# EAGLE design 180 schematic 3 layer (EAGLE 9.6.2)
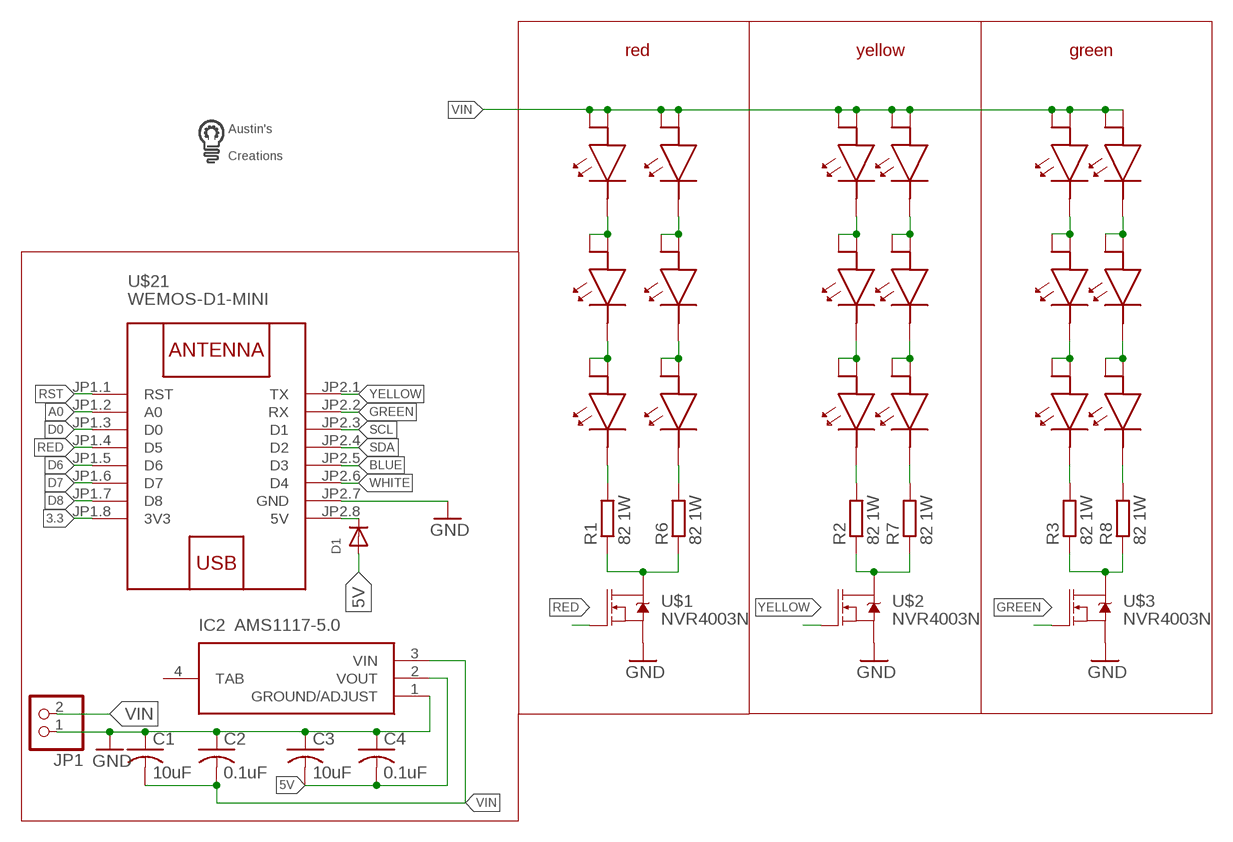
[diagram p0: schematic, sheet 1]

## Parts
C1  10uF  C-USC0603  [C0603]
C2  0.1uF  C-USC0603  [C0603]
C3  10uF  C-USC0603  [C0603]
C4  0.1uF  C-USC0603  [C0603]
D1  DIODESOD-123  [SOD-123]
IC2  AMS1117-5.0  [SOT229P700X180-4N]
JP1  PINHD-1X2  [1X02]
R1  82 1W  R-EU_R2010  [R2010]
R2  82 1W  R-EU_R2010  [R2010]
R3  82 1W  R-EU_R2010  [R2010]
R6  82 1W  R-EU_R2010  [R2010]
R7  82 1W  R-EU_R2010  [R2010]
R8  82 1W  R-EU_R2010  [R2010]
U$1  NVR4003N  [SOT23]
U$2  NVR4003N  [SOT23]
U$3  NVR4003N  [SOT23]
U$6  5730LED  [5730LED]
U$7  5730LED  [5730LED]
U$8  5730LED  [5730LED]
U$9  5730LED  [5730LED]
U$10  5730LED  [5730LED]
U$11  5730LED  [5730LED]
U$12  5730LED  [5730LED]
U$13  5730LED  [5730LED]
U$14  5730LED  [5730LED]
U$21  WEMOS-D1-MINI  [WEMOS-D1-MINI]
U$22  LOGO  [LOGO]
U$23  5730LED  [5730LED]
U$24  5730LED  [5730LED]
U$25  5730LED  [5730LED]
U$26  5730LED  [5730LED]
U$27  5730LED  [5730LED]
U$28  5730LED  [5730LED]
U$29  5730LED  [5730LED]
U$30  5730LED  [5730LED]
U$31  5730LED  [5730LED]

## Nets
3.3: U$21.JP1.8(3V3)
5V: C3.2 C4.2 D1.A IC2.2(VOUT)
A0: U$21.JP1.2(A0)
BLUE: U$21.JP2.5(D3)
D0: U$21.JP1.3(D0)
D6: U$21.JP1.5(D6)
D7: U$21.JP1.6(D7)
D8: U$21.JP1.7(D8)
GND: C1.1 C2.1 C3.1 C4.1 IC2.1(GROUND/ADJUST) JP1.1 U$1.3(S) U$2.3(S) U$3.3(S) U$21.JP2.7(GND)
GREEN: U$3.2(G) U$21.JP2.2(RX)
N$1: D1.C U$21.JP2.8(5V)
N$2: U$6.P$2 U$7.P$1 U$7.P$3
N$3: U$9.P$2 U$10.P$1 U$10.P$3
N$4: R1.1 R6.1 U$1.1(D)
N$5: R2.1 R7.1 U$2.1(D)
N$6: U$12.P$2 U$13.P$1 U$13.P$3
N$9: U$7.P$2 U$8.P$1 U$8.P$3
N$10: R1.2 U$8.P$2
N$11: R2.2 U$11.P$2
N$12: R3.2 U$14.P$2
N$17: U$13.P$2 U$14.P$1 U$14.P$3
N$18: U$10.P$2 U$11.P$1 U$11.P$3
N$19: U$23.P$2 U$24.P$1 U$24.P$3
N$20: U$24.P$2 U$25.P$1 U$25.P$3
N$21: R3.1 R8.1 U$3.1(D)
N$24: R6.2 U$25.P$2
N$25: U$29.P$2 U$30.P$1 U$30.P$3
N$26: U$26.P$2 U$27.P$1 U$27.P$3
N$27: R7.2 U$28.P$2
N$28: U$27.P$2 U$28.P$1 U$28.P$3
N$29: R8.2 U$31.P$2
N$30: U$30.P$2 U$31.P$1 U$31.P$3
RED: U$1.2(G) U$21.JP1.4(D5)
RST: U$21.JP1.1(RST)
SCL: U$21.JP2.3(D1)
SDA: U$21.JP2.4(D2)
VIN: C1.2 C2.2 IC2.3(VIN) JP1.2 U$6.P$1 U$6.P$3 U$9.P$1 U$9.P$3 U$12.P$1 U$12.P$3 U$23.P$1 U$23.P$3 U$26.P$1 U$26.P$3 U$29.P$1 U$29.P$3
WHITE: U$21.JP2.6(D4)
YELLOW: U$2.2(G) U$21.JP2.1(TX)
Unconnected: IC2.4(TAB)

## Notes on the sheet
- red | yellow | green

## Library data of the parts
C1-C4 = adafruit:C-US: CAPACITOR, American symbol
D1 = adafruit:DIODE: Diode SMADIODE - SMA Surface Mount Package 20V 1A Schottky Diode Digikey: 641-1014-6-ND DO-1N4148 - Through Hole Small Current Diode SOD-123 20V 1 A (.5mV Vf) Schottky Diode - Digikey: MBRX120TPMSCT-ND SOD-323 10V 570mA (.38mV Vf, 3ns) Schottky Diode - Digikey: ZLLS410CT-ND SOD-523 30V 30mA Schottky Diode (RB751S-40TE61) - Digikey: RB751S-40TE61CT-ND SOT23-R/W - SOT23 Package (R = Solder Paste/Reflow Ovens, W = Hand-Soldering) BAT54Film 40V 300mA - Digikey: 497-7162-1-ND
IC2 = SamacSys_Parts:AMS1117-5.0: 1A LOW DROPOUT VOLTAGE REGULATOR Source: Datasheet <http://www.advanced-monolithic.com/pdf/ds1117.pdf>; DESCRIPTION: 1A LOW DROPOUT VOLTAGE REGULATOR; HEIGHT: 1.8mm; MANUFACTURER_NAME: Advanced Monolithic Systems; MANUFACTURER_PART_NUMBER: AMS1117-5.0
JP1 = pinhead:PINHD-1X2: PIN HEADER
R1-R3 R6-R8 = rcl:R-EU_: RESISTOR, European symbol; SPICEPREFIX: R
U$1-U$3 = custom parts:NVR4003N
U$6-U$14 U$23-U$31 = custom parts:5730LED
U$21 = diy-modules:WEMOS-D1-MINI: WEMOS D1 mini: Mini Wi-Fi Board based on ESP-8266 device More details can be found here: https://www.wemos.cc/product/d1-mini.html Click here to find device on ebay.com <http://www.ebay.com/sch/wemos+d1+mini+nodemcu>
U$22 = custom parts:LOGO

## Board
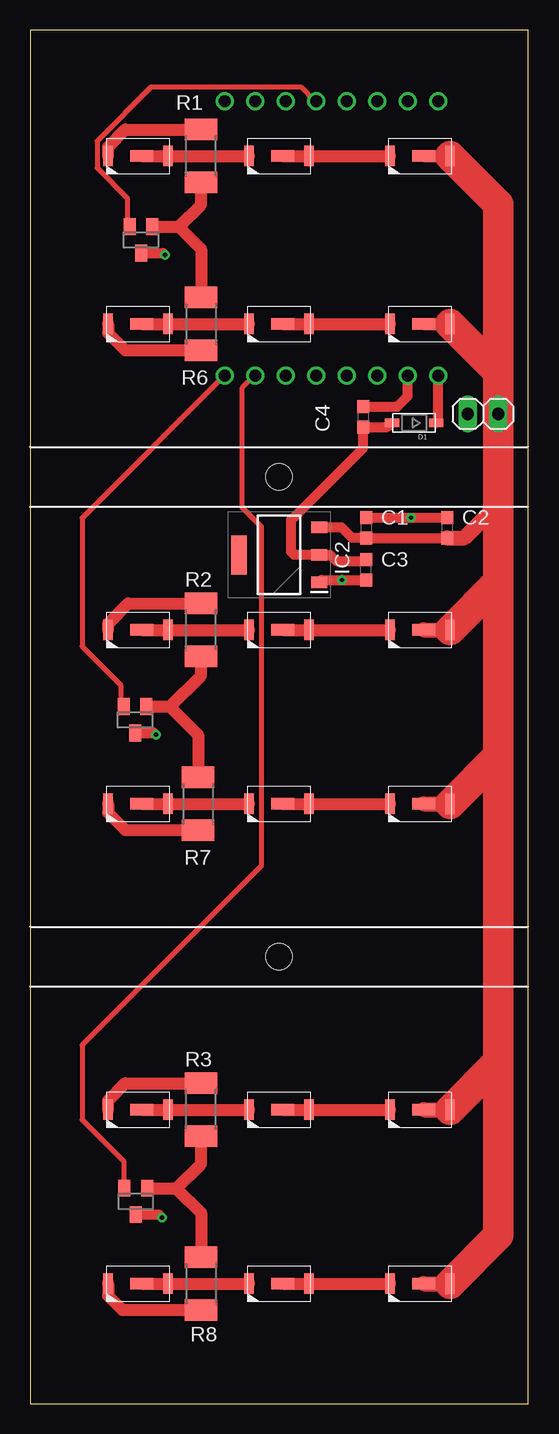
[diagram p1: board, top side]
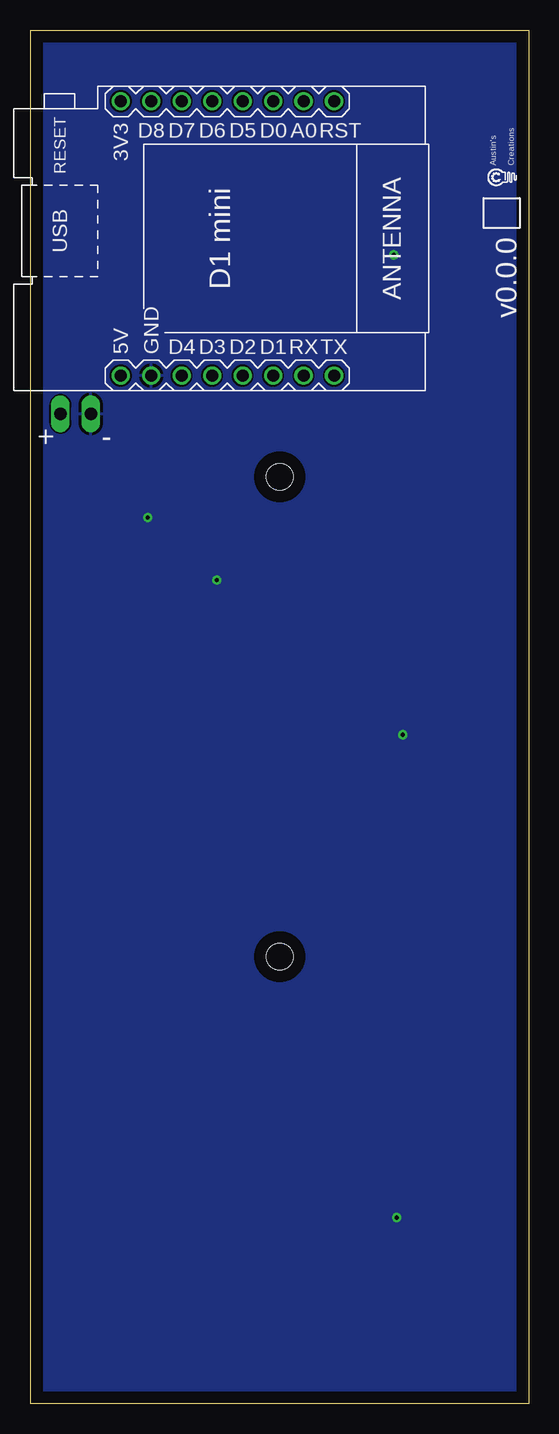
[diagram p2: board, bottom side, seen from below]

Size 41.5 x 114.5 mm. Coordinates in mm from the lower left corner, seen from the top.
Outline: 0,0 41.5,0 41.5,114.5 0,114.5 0,0
Copper layers (1*16): Top 0.035mm / dielectric 1.5mm / Bottom 0.035mm
Design rules "default *": minimum track width 16mil, minimum drill 0.35mm, track to track 6mil, track to pad 6mil, pad to pad 6mil, via to via 6mil, smd to smd 6mil, copper to edge 40mil, drill to drill 6mil, minimum pad ring 10mil, minimum via ring 8mil, stop-mask expansion 4mil, vias tented up to drill 0mil, thermal gap 10mil
Holes 2.2 mm at 20.75,77.25 20.75,37.25

### Footprints (pad centres in the part's own frame; a part is rotated, then mirrored left to right if it is on the bottom)
C0603 = smd 1.1 x 1: 1 -0.85,0; 2 0.85,0
SOD-123 = smd 1.2 x 0.7: A 1.85,0; C -1.85,0
SOT229P700X180-4N = smd 1.3 x 0.95: 1 -3.35,2.29; 2 -3.35,0; 3 -3.35,-2.29 | smd 1.3 x 3.25: 4 3.35,0
1X02 = drill 1.016 long: 1 -1.27,0; 2 1.27,0
R2010 = smd 1.8 x 2.7: 1 -2.2,0; 2 2.2,0
SOT23 = smd 1 x 1.4: 1 -0.95,-1.1; 2 0.95,-1.1; 3 0,1.1
5730LED = smd 0.813 x 1.676: P$1 -2.5,0; P$2 2.5,0 | smd 1.93 x 0.965: P$3 -0.3,0
WEMOS-D1-MINI = drill 1: JP1.1 -11.43,9.525; JP1.2 -11.43,6.985; JP1.3 -11.43,4.445; JP1.4 -11.43,1.905; JP1.5 -11.43,-0.635; JP1.6 -11.43,-3.175; JP1.7 -11.43,-5.715; JP1.8 -11.43,-8.255; JP2.1 11.43,9.525; JP2.2 11.43,6.985; JP2.3 11.43,4.445; JP2.4 11.43,1.905; JP2.5 11.43,-0.635; JP2.6 11.43,-3.175; JP2.7 11.43,-5.715; JP2.8 11.43,-8.255

### Placement (x,y rotation side)
C1  28,73 270 top
C2  34.75,73 270 top
C3  28,69.5 90 top
C4  27.75,82.25 270 top
D1  32,81.75 180 top
IC2  20.75,70.75 180 top
JP1  37.75,82.5 0 top
R1  14.25,104 90 top
R2  14.25,64.5 90 top
R3  14.25,24.5 90 top
R6  14.25,90 270 top
R7  14,50 270 top
R8  14.25,10 270 top
U$1  9.25,97 180 top
U$2  8.75,57 180 top
U$3  8.82,16.86 180 top
U$6  32.5,104 180 top
U$7  20.75,104 180 top
U$8  9,104 180 top
U$9  32.5,64.5 180 top
U$10  20.75,64.5 180 top
U$11  9,64.5 180 top
U$12  32.5,24.5 180 top
U$13  20.75,24.5 180 top
U$14  9,24.5 180 top
U$21  25.75,97.12 270 bottom
U$22  1,101.5 90 bottom
U$23  32.5,90 180 top
U$24  20.75,90 180 top
U$25  9,90 180 top
U$26  32.5,50 180 top
U$27  20.75,50 180 top
U$28  9,50 180 top
U$29  32.5,10 180 top
U$30  20.75,10 180 top
U$31  9,10 180 top

### Tracks (layer width: path | path; a pad name or v marks a point on that pad's centre or on a via)
5V
  Top 0.813: C3.2 27.9,70.25 25.5,70.25 25,70.75 IC2.2 22,70.75 21.75,71 21.75,73.65 27.75,79.65 C4.2 29.8,81.4 D1.A
GND  (via drill 0.35)
  Top 0.813: C1.1 v31.75,73.85 C2.1 | IC2.1 24.29,68.65 v26,68.65 C3.1 | U$2.3 10.35,55.9 v10.5,55.75 | U$1.3 11.1,95.9 v11.25,95.75 | U$3.3 10.74,15.76 v11,15.5 | C4.1 30.6,83.1 31.46,83.97 U$21.JP2.7
  pour Bottom: 0,114.5 0,0 41.5,0 41.5,114.5
GREEN
  Top 0.406: U$3.2 7.82,18.07 7.82,20.17 4.34,23.66 4.34,29.89 19.28,44.83 19.28,73.1 17.66,74.71 17.66,84.62 18.72,85.68 U$21.JP2.2
N$1
  Top 0.813: D1.C 34.01,81.91 U$21.JP2.8
N$2
  Top 1.016: U$7.P$3 U$7.P$1 U$6.P$2
N$3
  Top 1.016: U$10.P$3 U$10.P$1 U$9.P$2
N$4
  Top 1.016: R6.1 14.25,96.25 12.4,98.1 | 12.4,98.1 14.25,99.95 R1.1 | U$1.1 12.4,98.1
N$5
  Top 1.016: R7.1 14,55.75 11.65,58.1 | 11.65,58.1 14.25,60.7 R2.1 | U$2.1 11.65,58.1
N$6
  Top 1.016: U$13.P$3 U$13.P$1 U$12.P$2
N$9
  Top 1.016: U$8.P$3 U$8.P$1 U$7.P$2
N$10
  Top 1.016: U$8.P$2 6.5,104.75 7.95,106.2 R1.2
N$11
  Top 1.016: U$11.P$2 6.5,65 8.2,66.7 R2.2
N$12
  Top 1.016: U$14.P$2 6.5,25.25 7.95,26.7 R3.2
N$17
  Top 1.016: U$14.P$3 U$14.P$1 U$13.P$2
N$18
  Top 1.016: U$11.P$3 U$11.P$1 U$10.P$2
N$19
  Top 1.016: U$24.P$3 U$24.P$1 U$23.P$2
N$20
  Top 1.016: U$25.P$3 U$25.P$1 U$24.P$2
N$21
  Top 1.016: U$3.1 12.21,17.96 | R3.1 14.25,20 12.21,17.96 | 12.21,17.96 14.25,15.92 R8.1
N$24
  Top 1.016: U$25.P$2 6.5,89.25 7.95,87.8 R6.2
N$25
  Top 1.016: U$30.P$3 U$30.P$1 U$29.P$2
N$26
  Top 1.016: U$27.P$3 U$27.P$1 U$26.P$2
N$27
  Top 1.016: U$28.P$2 6.5,49.25 7.95,47.8 R7.2
N$28
  Top 1.016: U$28.P$3 U$28.P$1 U$27.P$2
N$29
  Top 1.016: U$31.P$2 6.5,9 7.7,7.8 R8.2
N$30
  Top 1.016: U$31.P$3 U$31.P$1 U$30.P$2
RED
  Top 0.406: U$1.2 8.1,98.26 8.1,100.49 5.59,103.01 5.59,105.24 10.06,109.71 22.63,109.71 23.75,108.59 U$21.JP1.4
VIN
  Top 0.813: C2.2 C1.2 26.85,72.15 25.96,73.04 IC2.3
  Top 1.016: U$23.P$3 U$23.P$1 | U$6.P$3 U$6.P$1
  Top 1.27: C2.2 36.17,72.15 39.02,75 | U$29.P$3 U$29.P$1 | U$12.P$3 U$12.P$1 | U$26.P$3 U$26.P$1 | U$9.P$3 U$9.P$1
  Top 2.54: 39.02,85.98 JP1.2 39.02,75 39.02,68.52 | 39.02,85.98 U$23.P$1 | 39.02,85.98 39.02,99.98 U$6.P$1 | 39.02,68.52 U$9.P$1 | 39.02,68.52 39.02,54.02 | 39.02,54.02 U$26.P$1 | 39.02,54.02 39.02,28.52 | 39.02,28.52 U$12.P$1 | 39.02,28.52 39.02,14.02 U$29.P$1
YELLOW
  Top 0.406: U$2.2 7.54,58.3 7.54,59.91 4.34,63.11 4.34,73.82 16.2,85.68 U$21.JP2.1

### Text on the board
bPlace: - | +
bNames: v0.0.0